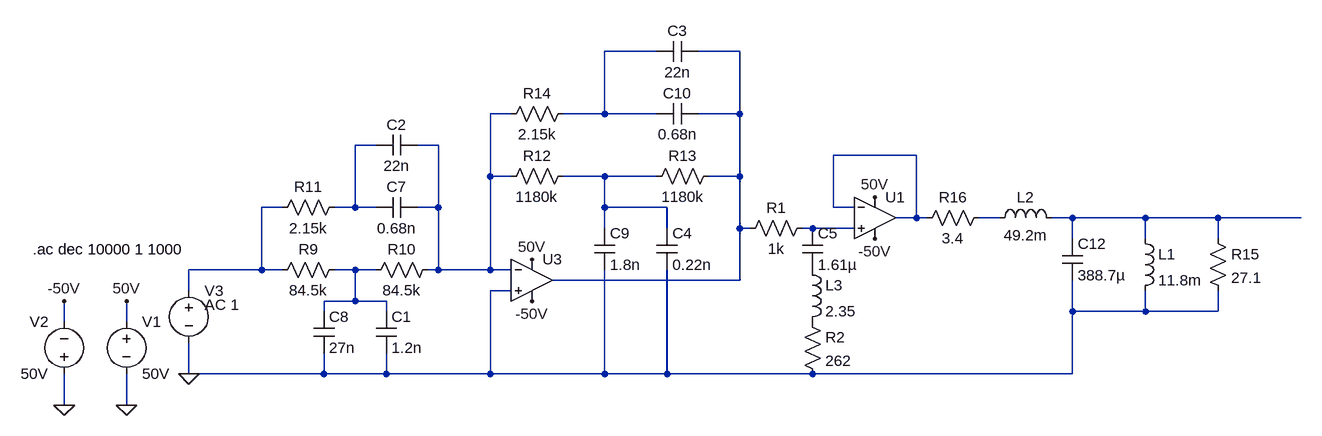
[diagram p0: schematic full_lt_pyle_notch.asc]
full_lt_pyle_notch.asc, the LTspice schematic file:
Version 4
SHEET 1 1284 1184
WIRE -704 224 -784 224
WIRE -576 224 -640 224
WIRE -928 320 -960 320
WIRE -784 320 -784 224
WIRE -784 320 -848 320
WIRE -704 320 -784 320
WIRE -576 320 -576 224
WIRE -576 320 -640 320
WIRE -1136 368 -1168 368
WIRE -1040 368 -1072 368
WIRE -304 384 -432 384
WIRE -960 416 -960 320
WIRE -928 416 -960 416
WIRE -784 416 -848 416
WIRE -704 416 -784 416
WIRE -576 416 -576 320
WIRE -576 416 -624 416
WIRE -1280 464 -1312 464
WIRE -1168 464 -1168 368
WIRE -1168 464 -1200 464
WIRE -1136 464 -1168 464
WIRE -1040 464 -1040 368
WIRE -1040 464 -1072 464
WIRE -784 464 -784 416
WIRE -688 464 -784 464
WIRE -432 464 -432 384
WIRE -400 464 -432 464
WIRE -304 480 -304 384
WIRE -304 480 -336 480
WIRE -288 480 -304 480
WIRE -176 480 -208 480
WIRE -64 480 -96 480
WIRE 48 480 -64 480
WIRE 160 480 48 480
WIRE 288 480 160 480
WIRE -784 496 -784 464
WIRE -688 496 -688 464
WIRE -576 496 -576 416
WIRE -560 496 -576 496
WIRE -464 496 -480 496
WIRE -400 496 -464 496
WIRE -64 512 -64 480
WIRE 48 512 48 480
WIRE 160 512 160 480
WIRE -1312 560 -1312 464
WIRE -1312 560 -1424 560
WIRE -1280 560 -1312 560
WIRE -1168 560 -1200 560
WIRE -1136 560 -1168 560
WIRE -1040 560 -1040 464
WIRE -1040 560 -1056 560
WIRE -960 560 -960 416
WIRE -960 560 -1040 560
WIRE -928 560 -960 560
WIRE -576 576 -576 496
WIRE -576 576 -864 576
WIRE -1424 592 -1424 560
WIRE -928 592 -960 592
WIRE -1168 608 -1168 560
WIRE -1168 608 -1216 608
WIRE -1120 608 -1168 608
WIRE -1216 624 -1216 608
WIRE -1120 624 -1120 608
WIRE -64 624 -64 576
WIRE 48 624 48 592
WIRE 48 624 -64 624
WIRE 160 624 160 592
WIRE 160 624 48 624
WIRE -1616 640 -1616 608
WIRE -1520 640 -1520 608
WIRE -1424 720 -1424 672
WIRE -1216 720 -1216 688
WIRE -1216 720 -1424 720
WIRE -1120 720 -1120 688
WIRE -1120 720 -1216 720
WIRE -960 720 -960 592
WIRE -960 720 -1120 720
WIRE -784 720 -784 560
WIRE -784 720 -960 720
WIRE -688 720 -688 560
WIRE -688 720 -784 720
WIRE -464 720 -688 720
WIRE -64 720 -64 624
WIRE -64 720 -464 720
WIRE -1616 768 -1616 720
WIRE -1520 768 -1520 720
FLAG -1424 720 0
FLAG -1520 608 50V
FLAG -1616 608 -50V
FLAG -1616 768 0
FLAG -1520 768 0
FLAG -896 544 50V
FLAG -896 608 -50V
FLAG -368 448 50V
FLAG -368 512 -50V
SYMBOL res -1184 544 R90
WINDOW 0 0 56 VBottom 2
WINDOW 3 32 56 VTop 2
SYMATTR InstName R9
SYMATTR Value 84.5k
SYMBOL res -1040 544 R90
WINDOW 0 0 56 VBottom 2
WINDOW 3 32 56 VTop 2
SYMATTR InstName R10
SYMATTR Value 84.5k
SYMBOL res -1184 448 R90
WINDOW 0 0 56 VBottom 2
WINDOW 3 32 56 VTop 2
SYMATTR InstName R11
SYMATTR Value 2.15k
SYMBOL cap -1072 448 R90
WINDOW 0 0 32 VBottom 2
WINDOW 3 32 32 VTop 2
SYMATTR InstName C7
SYMATTR Value 0.68n
SYMBOL Opamps/UniversalOpamp2 -896 576 R0
SYMATTR InstName U3
SYMBOL cap -1232 624 R0
SYMATTR InstName C8
SYMATTR Value 27n
SYMBOL res -832 400 R90
WINDOW 0 0 56 VBottom 2
WINDOW 3 32 56 VTop 2
SYMATTR InstName R12
SYMATTR Value 1180k
SYMBOL cap -800 496 R0
SYMATTR InstName C9
SYMATTR Value 1.8n
SYMBOL res -608 400 R90
WINDOW 0 0 56 VBottom 2
WINDOW 3 32 56 VTop 2
SYMATTR InstName R13
SYMATTR Value 1180k
SYMBOL res -832 304 R90
WINDOW 0 0 56 VBottom 2
WINDOW 3 32 56 VTop 2
SYMATTR InstName R14
SYMATTR Value 2.15k
SYMBOL cap -640 304 R90
WINDOW 0 0 32 VBottom 2
WINDOW 3 32 32 VTop 2
SYMATTR InstName C10
SYMATTR Value 0.68n
SYMBOL cap -80 512 R0
SYMATTR InstName C12
SYMATTR Value 388.7µ
SYMBOL ind 32 496 R0
SYMATTR InstName L1
SYMATTR Value 11.8m
SYMBOL res 144 496 R0
SYMATTR InstName R15
SYMATTR Value 27.1
SYMBOL res -192 464 R90
WINDOW 0 0 56 VBottom 2
WINDOW 3 32 56 VTop 2
SYMATTR InstName R16
SYMATTR Value 3.4
SYMBOL voltage -1424 576 R0
WINDOW 123 24 38 Left 2
WINDOW 39 0 0 Left 0
SYMATTR Value2 AC 1
SYMATTR InstName V3
SYMATTR Value ""
SYMBOL voltage -1520 624 R0
SYMATTR InstName V1
SYMATTR Value 50V
SYMBOL voltage -1616 736 R180
WINDOW 0 24 96 Left 2
WINDOW 3 24 16 Left 2
SYMATTR InstName V2
SYMATTR Value 50V
SYMBOL cap -1136 624 R0
SYMATTR InstName C1
SYMATTR Value 1.2n
SYMBOL cap -1072 352 R90
WINDOW 0 0 32 VBottom 2
WINDOW 3 32 32 VTop 2
SYMATTR InstName C2
SYMATTR Value 22n
SYMBOL cap -640 208 R90
WINDOW 0 0 32 VBottom 2
WINDOW 3 32 32 VTop 2
SYMATTR InstName C3
SYMATTR Value 22n
SYMBOL cap -704 496 R0
SYMATTR InstName C4
SYMATTR Value 0.22n
SYMBOL ind -192 496 R270
WINDOW 0 32 56 VTop 2
WINDOW 3 5 56 VBottom 2
SYMATTR InstName L2
SYMATTR Value 49.2m
SYMBOL res -464 480 R90
WINDOW 0 0 56 VBottom 2
WINDOW 3 32 56 VTop 2
SYMATTR InstName R1
SYMATTR Value 1k
SYMBOL cap -480 496 R0
SYMATTR InstName C5
SYMATTR Value 1.61µ
SYMBOL ind -480 544 R0
SYMATTR InstName L3
SYMATTR Value 2.35
SYMBOL res -480 624 R0
SYMATTR InstName R2
SYMATTR Value 262
SYMBOL Opamps/UniversalOpamp2 -368 480 R0
SYMATTR InstName U1
TEXT -1664 528 Left 2 !.ac dec 10000 1 1000

The netlist it stands for:
* full_lt_pyle_notch.asc
R9 N011 N007 84.5k
R10 N003 N011 84.5k
R11 N004 N007 2.15k
C7 N003 N004 0.68n
XU3 0 N003 50V -50V N002 level.2 Avol=1Meg GBW=10Meg Slew=10Meg ilimit=25m rail=0 Vos=0 phimargin=45 en=0 enk=0 in=0 ink=0 Rin=500Meg  ; pins IN+ IN- V+ V- OUT
C8 N011 0 27n
R12 N006 N003 1180k
C9 N006 0 1.8n
R13 N002 N006 1180k
R14 N001 N003 2.15k
C10 N002 N001 0.68n
C12 N009 0 388.7µ
L1 N009 0 11.8m
R15 N009 0 27.1
R16 N008 N005 3.4
V3 N007 0 AC 1
V1 50V 0 50V
V2 0 -50V 50V
C1 N011 0 1.2n
C2 N003 N004 22n
C3 N002 N001 22n
C4 N006 0 0.22n
L2 N008 N009 49.2m
R1 N010 N002 1k
C5 N010 P001 1.61µ
L3 P001 P002 2.35
R2 P002 0 262
XU1 N010 N005 50V -50V N005 level.2 Avol=1Meg GBW=10Meg Slew=10Meg ilimit=25m rail=0 Vos=0 phimargin=45 en=0 enk=0 in=0 ink=0 Rin=500Meg  ; pins IN+ IN- V+ V- OUT
.ac dec 10000 1 1000
.lib UniversalOpamps2.sub
.backanno
.end